# Altium schematic sheet MAIN_STM32L476RGT6.SchDoc
size B; SheetNumber: 4
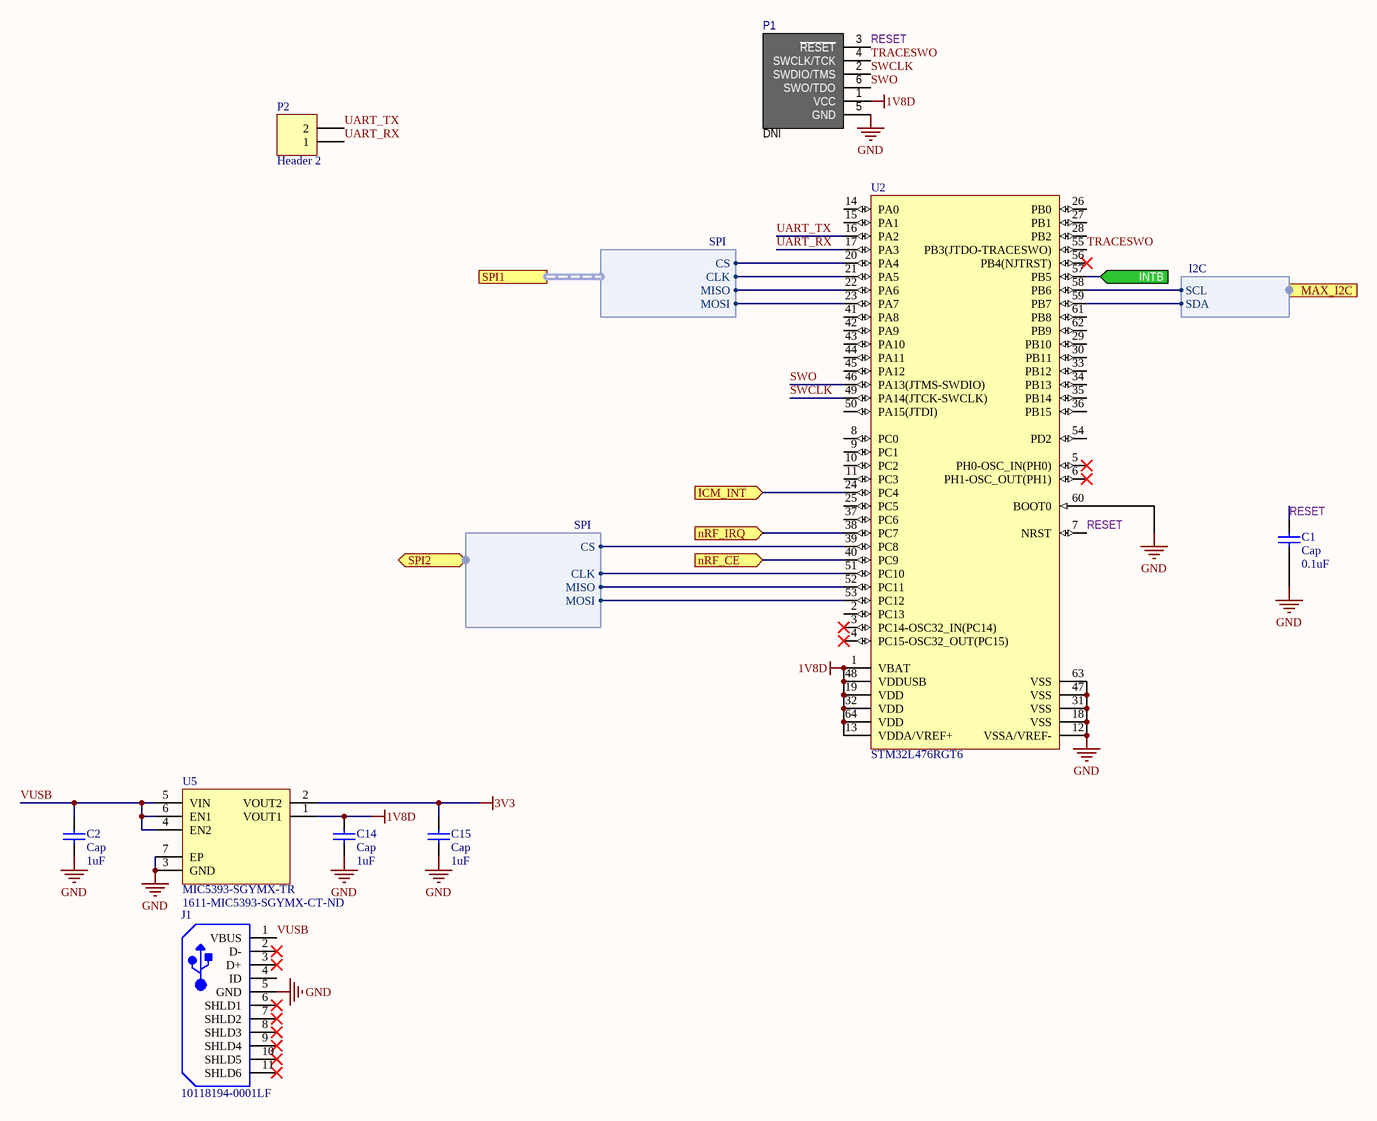
[diagram p0: MAIN_STM32L476RGT6.SchDoc]

## Parts
C1  Cap  value 0.1uF  [CAPC1005N]
C2  Cap  value 1uF  [CAPC1005N]
C14  Cap  value 1uF  [CAPC1005N]
C15  Cap  value 1uF  [CAPC1005N]
J1  10118194-0001LF  [FCI-10118194-0001LF-5_V]
P1  DNI  [TC2030]  (no BOM)
P2  Header 2  [HDR1X2-PINS]
U2  STM32L476RGT6  [STM-LQFP64_N]
U5  MIC5393-SGYMX-TR  Supplier Part Number 1: 1611-MIC5393-SGYMX-CT-ND  [MIC5392]

## Ports
ICM_INT (in), INTB (in), MAX_I2C (harness I2C), nRF_CE (in), nRF_IRQ (in), SPI1 (harness SPI), SPI2 (bidir, harness SPI)

## Harnesses
I2C: SCL, SDA
SPI: MOSI, MISO, CS, CLK

## Nets
1V8D: C14.2 P1.1(VCC) U2.1(VBAT) U2.13(VDDA/VREF+) U2.19(VDD) U2.32(VDD) U2.48(VDDUSB) U2.64(VDD) U5.1(VOUT1)
3V3: C15.2 U5.2(VOUT2)
GND: C1.1 C2.1 C14.1 C15.1 J1.5(GND) P1.5(GND) U2.12(VSSA/VREF-) U2.18(VSS) U2.31(VSS) U2.47(VSS) U2.60(BOOT0) U2.63(VSS) U5.3(GND) U5.7(EP)
ICM_INT: U2.24(PC4) ; port ICM_INT
INTB: U2.57(PB5) ; port INTB
nRF_CE: U2.40(PC9) ; port nRF_CE
nRF_IRQ: U2.38(PC7) ; port nRF_IRQ
RESET: C1.2 P1.3(~{RESET}) U2.7(NRST)
SWCLK: P1.2(SWDIO/TMS) U2.49(PA14(JTCK-SWCLK))
SWO: P1.6(SWO/TDO) U2.46(PA13(JTMS-SWDIO))
TRACESWO: P1.4(SWCLK/TCK) U2.55(PB3(JTDO-TRACESWO))
UART_RX: P2.1 U2.17(PA3)
UART_TX: P2.2 U2.16(PA2)
VUSB: C2.2 J1.1(VBUS) U5.4(EN2) U5.5(VIN) U5.6(EN1)
NetU2_20: U2.20(PA4) ; port SPI1.CS
NetU2_21: U2.21(PA5) ; port SPI1.CLK
NetU2_22: U2.22(PA6) ; port SPI1.MISO
NetU2_23: U2.23(PA7) ; port SPI1.MOSI
NetU2_39: U2.39(PC8) ; port SPI2.CS
NetU2_51: U2.51(PC10) ; port SPI2.CLK
NetU2_52: U2.52(PC11) ; port SPI2.MISO
NetU2_53: U2.53(PC12) ; port SPI2.MOSI
NetU2_58: U2.58(PB6) ; port MAX_I2C.SCL
NetU2_59: U2.59(PB7) ; port MAX_I2C.SDA

Not connected (* = marked no-connect by the designer): J1 2(D-)* 3(D+)* 4(ID) 6(SHLD1)* 7(SHLD2)* 8(SHLD3)* 9(SHLD4)* 10(SHLD5)* 11(SHLD6)*; U2 2(PC13) 3(PC14-OSC32_IN(PC14))* 4(PC15-OSC32_OUT(PC15))* 5(PH0-OSC_IN(PH0))* 6(PH1-OSC_OUT(PH1))* 8(PC0) 9(PC1) 10(PC2) 11(PC3) 14(PA0) 15(PA1) 25(PC5) 26(PB0) 27(PB1) 28(PB2) 29(PB10) 30(PB11) 33(PB12) 34(PB13) 35(PB14) 36(PB15) 37(PC6) 41(PA8) 42(PA9) 43(PA10) 44(PA11) 45(PA12) 50(PA15(JTDI)) 54(PD2) 56(PB4(NJTRST))* 61(PB8) 62(PB9)

## Library data of the parts
C1 C2 C14 C15 = Cap: Capacitor; Published: 8-Jun-2000; LatestRevisionDate: 17-Jul-2002; LatestRevisionNote: Re-released for DXP Platform.; PackageReference: RAD-0.3; Publisher: Altium Limited; PackageDescription: Radial Cap, Thru-Hole; 2 Leads; 0.3 in Pin Spacing
J1 = CMP-2000-05120-1: Micro USB B Type Receptacle, 1.8 A, -55 to 85 degC, 5-Pin SMD, RoHS, Tape and Reel; Manufacturer: Amphenol FCI; Body Orientation: RightAngle; Number of Contacts: 5; Pitch: 0.65mm; Gender: RCP; Rad Hard: No; Package Reference: 10118194-0001LF-5; Mounting: SurfaceMount; Manufacturer URL: http://www.fci.com/; Packaging: CutTape; Datasheet URL: https://datasheet.ciiva.com/26945/getdatasheetpartid-418619-26945695.pdf; Termination Method: Solder; Package Description: 5-Pin Surface Mount Device, Body 8.05 x 5.53 mm, Pitch 0.65 mm; Type: MicroUSBTypeB; Datasheet Version: Rev. A, 10/2011
P1 = TC2030-CTX
P2 = Header 2: Header, 2-Pin; LatestRevisionDate: 17-Jul-2002; LatestRevisionNote: Re-released for DXP Platform.; Publisher: Altium Limited
U2 = CMP-1655-00012-2: Ultra-Low-Power ARM Cortex-M4 32-bit MCU+FPU, 1024 KB Flash, 128 KB Internal RAM, 51 I/Os, 64-Pin LQFP, -40 to 85 degC, Tray; Manufacturer: STMicroelectronics; D/A Converter: 2; Supply Voltage(Vcc) min (V): 1.71; Internal RAM Size (kB): 128; Operating Frequency(F) (Processor speed) (MHz): 80; FLASH Size (Prog) (kB): 1024; I/Os (High Current): 51; Core: ARM Cortex-M4; Package Reference: LQFP64; DatasheetVersion: Rev. 4; ComponentLink1URL: http://www.st.com/; ComponentLink2Description: Datasheet; Mounting Technology: Surface Mount; Package Description: 64-Pin Low-profile Quad Flat Package, Body 10 x 10 mm, Pitch 0.5 mm; ComponentLink1Description: Manufacturer URL; ComponentLink2URL: http://www.st.com/st-web-ui/static/active/en/resource/technical/document/datasheet/DM00108832.pdf; Packing: Tray; PartNumber: STM32L476RGT6
U5 = MIC5393-SGYMX-TR: IC REG LINEAR 1.8V/3.3V 6XTDFN; Manufacturer 1: Microchip; Output Voltage: 1.8V; Output Current: 150mA; Dropout Voltage: 155mV; Number of Regulators: 2; Min Current Limit: 200mA; Supplier 1: Digi-Key; Manufacturer Part Number 1: MIC5393-SGYMX-TR; Stock 1: 4457; Pricing 1: 1=0.13000, 25=0.10520, 100=0.10000 (USD); RoHS: Yes; Mount: Surface Mount; Min Operating Temperature: -40°C; Max Operating Temperature: 125°C; Packaging: Tape and Reel; ComponentLink1URL: http://www.microchip.com/mymicrochip/filehandler.aspx?ddocname=en580190&src-supplier=Digi-Key; ComponentLink1Description: http://www.microchip.com/mymicrochip/filehandler.aspx?ddocname=en580190&src-supplier=Digi-Key